# Altium project PCB_Project.PrjPcb
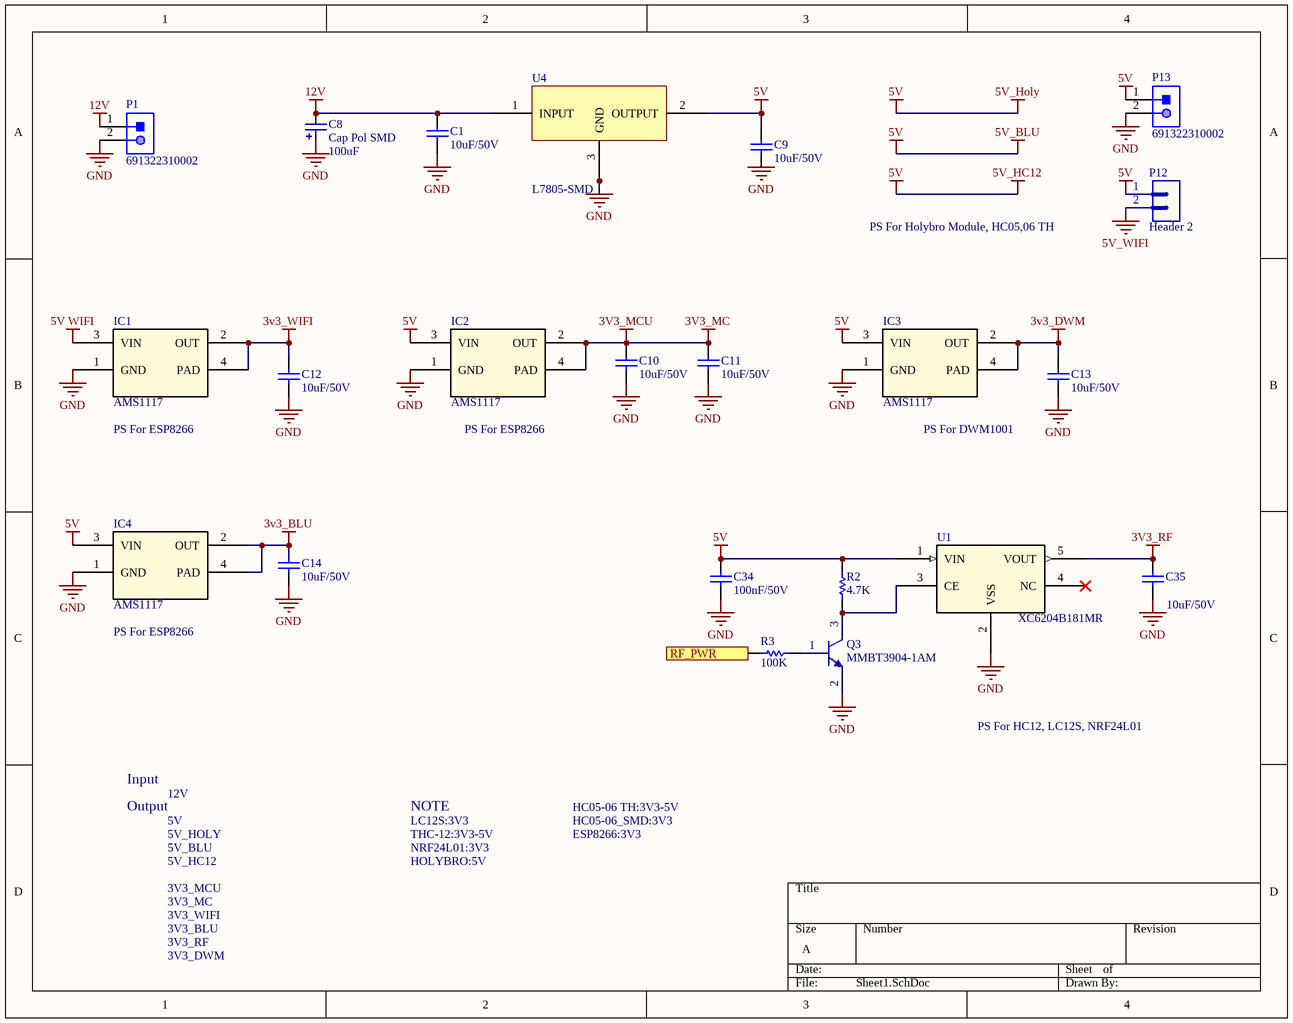
[diagram p0: Sheet1.SchDoc]
8 sheets, 150 parts. Net scope: flat (ports and power ports of the same name join across sheets).
Board file: PCB1.PcbDoc
Sheets:
  Sheet1.SchDoc
  Sheet2.SchDoc
  Sheet3.SchDoc
  Sheet4.SchDoc
  Sheet6.SchDoc
  Sheet5.SchDoc
  Sheet8.SchDoc
  Sheet7.SchDoc

## Sheet Sheet1.SchDoc
size A

### Parts
(Parts that share a designator on the sheet are numbered #1, #2 ... from top to bottom, then left to right.)
C1  value 10uF/50V  [CAP-SM-0805]  (hidden comment: Cap-10uF-50V-0805)
C8  Cap Pol SMD  value 100uF  [CAP ALU SIZE B]
C9  value 10uF/50V  [CAP-SM-0805]  (hidden comment: Cap-10uF-50V-0805)
C10  value 10uF/50V  [CAP-SM-0805]  (hidden comment: Cap-10uF-50V-0805)
C11  value 10uF/50V  [CAP-SM-0805]  (hidden comment: Cap-10uF-50V-0805)
C12  value 10uF/50V  [CAP-SM-0805]  (hidden comment: Cap-10uF-50V-0805)
C13  value 10uF/50V  [CAP-SM-0805]  (hidden comment: Cap-10uF-50V-0805)
C14  value 10uF/50V  [CAP-SM-0805]  (hidden comment: Cap-10uF-50V-0805)
C34  value 100nF/50V  [CAP-SM-0805]  (hidden comment: Cap-100nF-50V-0805)
C35  value 10uF/50V  [CAP-SM-0805]  (hidden comment: Cap-10uF-50V-0805)
IC1  AMS1117  [AMS1117]
IC2  AMS1117  [AMS1117]
IC3  AMS1117  [AMS1117]
IC4  AMS1117  [AMS1117]
P1  691322310002  [691322310002]
P12#1  Header 2  [JP2]
P13#1  691322310002  [691322310002]
Q3  MMBT3904-1AM  [SOT23_NEX]
R2  value 4.7K  [RES-SM-0805]  (hidden comment: Res-1K-0805)
R3  value 100K  [RES-SM-0805]  (hidden comment: Res-1K-0805)
U1  XC6204B181MR  [XC6204B332MR]
U4#1  L7805-SMD  [L7805-SMD]

### Ports
RF_PWR (in)

### Nets
3v3_BLU: C14.2 IC4.2(OUT) IC4.4(PAD)
3v3_DWM: C13.2 IC3.2(OUT) IC3.4(PAD)
3V3_MC: C10.2 C11.2 IC2.2(OUT) IC2.4(PAD)  [also labelled 3V3_MCU]
3V3_RF: C35.2 U1.5(VOUT)
3v3_WIFI: C12.2 IC1.2(OUT) IC1.4(PAD)
5V: C9.2 C34.2 IC2.3(VIN) IC3.3(VIN) IC4.3(VIN) P12#1.1 P13#1.1 R2.2 U1.1(VIN) U4#1.2(OUTPUT)  [also labelled 5V_BLU, 5V_HC12, 5V_Holy]
5V WIFI: IC1.3(VIN)
5V_WIFI: P12#1.2
12V: C1.2 C8.2 P1.1 U4#1.1(INPUT)
GND: C1.1 C8.1 C10.1 C11.1 C12.1 C13.1 C14.1 C34.1 C35.1 IC1.1(GND) IC2.1(GND) IC3.1(GND) IC4.1(GND) P1.2 P13#1.2 Q3.2(E) U1.2(VSS) U4#1.3(GND)
NetCR1_15: R3.2 ; port RF_PWR
NetQ3_1: Q3.1(B) R3.1
NetQ3_3: Q3.3(C) R2.1 U1.3(CE)

Not connected (* = marked no-connect by the designer): C9 1; U1 4(NC)*

### Notes on the sheet
- PS For Holybro Module, HC05,06 TH
- PS For ESP8266
- PS For DWM1001
- PS For HC12, LC12S, NRF24L01
- Input
- Output
- 12V
- 5V
- 5V_HOLY
- NOTE
- LC12S:3V3
- THC-12:3V3-5V
- HC05-06 TH:3V3-5V
- HC05-06_SMD:3V3
- ESP8266:3V3
- 5V_BLU
- 5V_HC12
- 3V3_MCU
- 3V3_MC
- NRF24L01:3V3
- HOLYBRO:5V
- 3V3_WIFI
- 3V3_BLU
- 3V3_RF
- 3V3_DWM
- Labels drawn without touching a wire or pin: GND

### Library data of the parts
C1 C9-C14 C35 = Cap-10uF-50V-0805: CAP CER 10UF 50V X5R 0805; Manufacturer: Yageo; Manufacturer Part Number: CC0805KKX5R9BB106; Local Supplier: thegioiic; Local Supplier Link: https://thegioiic.com/products/tu-10uf-50v-0805; Supplier 1: Digikey; Supplier 1 Link: https://www.digikey.com/product-detail/en/yageo/CC0805KKX5R9BB106/311-3499-2-ND/7164383; Supplier 1 Part Number: 311-3499-2-ND
C8 = Cap Pol SMD: Polarized Capacitor (Radial)
C34 = Cap-100nF-50V-0805: CAP CER 0.1UF 50V Y5V 0805; Manufacturer: Samsung Electro-Mechanics; Manufacturer Part Number: CL21F104ZBCNNNC; Local Supplier: thegioiic; Local Supplier Link: https://thegioiic.com/products/tu-100nf-0-1uf-50v-0805; Supplier 1: Digikey; Supplier 1 Part Number: 1276-1007-1-ND; Supplier 1 Link: https://www.digikey.com/product-detail/en/samsung-electro-mechanics/CL21F104ZBCNNNC/1276-1007-1-ND/3889093
IC1-IC4 = AMS1117: Vendor: Advanced Monolithic Systems; Built_By: EMA_Matt; SourceLibrary: Advanced_Monolithic_Systems_10-16-2019; Copyright: Copyright (C) 2018 Accelerated Designs. All rights reserved; Manufacturer_Part_Number: AMS1117; RefDes: RefDes; Type: DEV
P1 P13#1 = 691322310002: WR-TBL Serie 322 Horizontal PCB Header, Pluggable, pitch 3.81mm, 2p; Compliance: RoHS; Modularity: No; Pin Number: 2; Rated Current [UL]: 10A; Working Voltage [UL]: 300VAC; ComponentLink1Description: Manufacturer; ComponentLink1URL: http://www.we-online.de; ComponentLink2URL: https://katalog.we-online.de/em/datasheet/691322310002.pdf; ComponentLink2Description: Datasheet; Mounting Technology: THT; Part Number: 691322310002; Packaging: Box; Operating Temperature: -40 to +105degC; PCB/Cable/Panel: PCB; Pitch: 3.81mm; Published Date: October 2019; Type: Horizontal; Publisher: Wurth Elektronik; Application: Pluggable
P12#1 = Header 2: Header, 2-Pin; LatestRevisionDate: 17-Jul-2002; LatestRevisionNote: Re-released for DXP Platform.; Publisher: Altium Limited
R2 R3 = Res-1K-0805: RES 1K OHM 1% 1/4W 0805; Manufacturer: Stackpole Electronics Inc; Manufacturer Part Number: RNCP0805FTD1K00; Local Supplier: thegioiic; Local Supplier Link: https://thegioiic.com/products/dien-tro-1k-ohm-0805-5; Supplier 1: Digikey; Supplier 1 Link: https://www.digikey.com/product-detail/en/stackpole-electronics-inc/RNCP0805FTD1K00/RNCP0805FTD1K00CT-ND/2240568; Supplier 1 Part Number: RNCP0805FTD1K00CT-ND
U1 = XC6204B181MR: Vendor: Torex Semiconductor; Built_By: EMA_UL_Team; SourceLibrary: Torex_2016-07-05_1; Manufacturer_Part_Number: XC6204B181MR; Copyright: Copyright (C) 2018 Accelerated Designs. All rights reserved; RefDes: RefDes; Type: DEV

## Sheet Sheet2.SchDoc
size A4
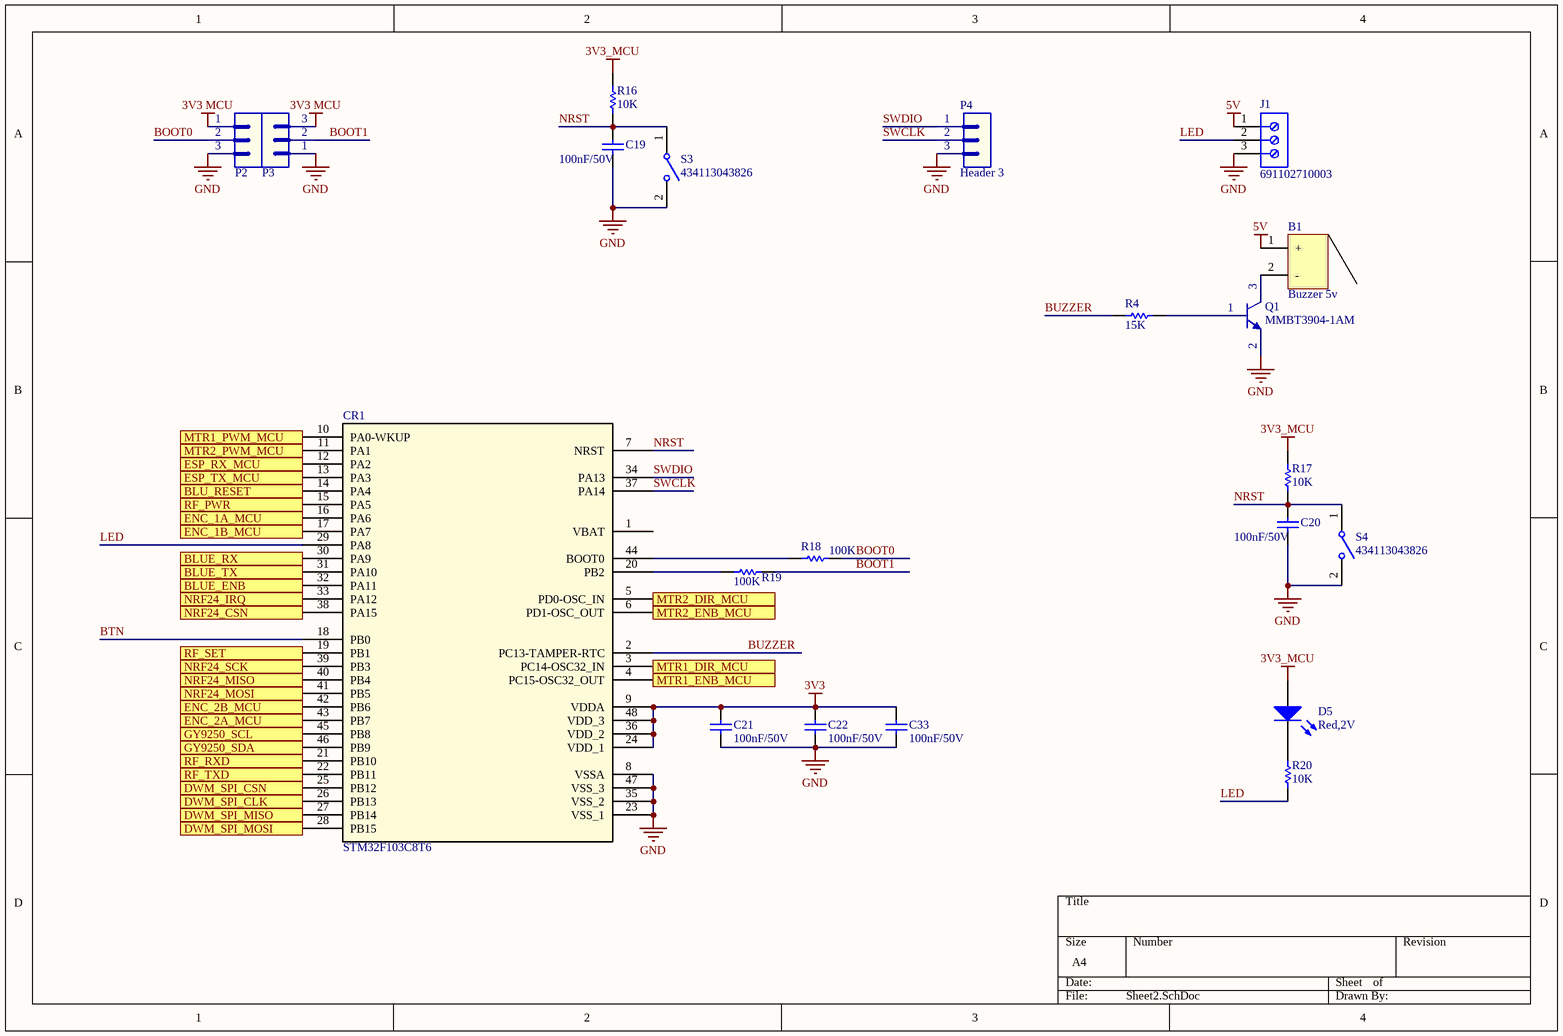
[diagram p1: Sheet2.SchDoc]

### Parts
(Parts that share a designator on the sheet are numbered #1, #2 ... from top to bottom, then left to right.)
B1  Buzzer 5v  [Buzzer 5v]
C19  value 100nF/50V  [CAP-SM-0805]  (hidden comment: Cap-1nF-50V-0805)
C20  value 100nF/50V  [CAP-SM-0805]  (hidden comment: Cap-1nF-50V-0805)
C21  value 100nF/50V  [CAP-SM-0805]  (hidden comment: Cap-1nF-50V-0805)
C22  value 100nF/50V  [CAP-SM-0805]  (hidden comment: Cap-1nF-50V-0805)
C33  value 100nF/50V  [CAP-SM-0805]  (hidden comment: Cap-1nF-50V-0805)
CR1  STM32F103C8T6  [STM32F103C8T6]
D5  value Red,2V  [LED-3mm]  (hidden comment: LED-RED-TH-3mm)
J1  691102710003  [691102710003]
P2  (no value)  [jp3]
P3  (no value)  [jp3]
P4  Header 3  [jp3]
Q1  MMBT3904-1AM  [SOT23_NEX]
R4  value 15K  [RES-SM-0805]  (hidden comment: Res-12K-0805)
R16  value 10K  [RES-SM-0805]  (hidden comment: Res-0-0805)
R17  value 10K  [RES-SM-0805]  (hidden comment: Res-0-0805)
R18  value 100K  [RES-SM-0805]  (hidden comment: Res-1K-0805)
R19#1  value 100K  [RES-SM-0805]  (hidden comment: Res-1K-0805)
R20  value 10K  [RES-SM-0805]  (hidden comment: Res-0-0805)
S3#1  434113043826  [434113043826]
S4#1  434113043826  [434113043826]

### Ports
BLU_RESET (out), BLUE_ENB (out), BLUE_RX (out), BLUE_TX (in), DWM_SPI_CLK (out), DWM_SPI_CSN (out), DWM_SPI_MISO (in), DWM_SPI_MOSI (out), ENC_1A_MCU (in), ENC_1B_MCU (in), ENC_2A_MCU (in), ENC_2B_MCU (in), ESP_RX_MCU (out), ESP_TX_MCU (in), GY9250_SCL (out), GY9250_SDA (out), MTR1_DIR_MCU (out), MTR1_ENB_MCU (out), MTR1_PWM_MCU (out), MTR2_DIR_MCU (out), MTR2_ENB_MCU (out), MTR2_PWM_MCU (out), NRF24_CSN (out), NRF24_IRQ (in), NRF24_MISO (in), NRF24_MOSI (out), NRF24_SCK (out), RF_PWR (out), RF_RXD (out), RF_SET (out), RF_TXD (in)

### Nets
3V3: C21.2 C22.2 C33.2 CR1.9(VDDA) CR1.24(VDD_1) CR1.36(VDD_2) CR1.48(VDD_3)
3V3 MCU: P2.1 P3.3
3V3_MCU: D5.1(A) R16.2 R17.2  [project net 3V3_MC]
5V: B1.1(+) J1.1
GND: C19.1 C20.1 C21.1 C22.1 C33.1 CR1.8(VSSA) CR1.23(VSS_1) CR1.35(VSS_2) CR1.47(VSS_3) J1.3 P2.3 P3.1 P4.3 Q1.2(E) S3#1.2 S4#1.2
BLUE_RX: CR1.30(PA9) ; port BLUE_RX
BOOT0: P2.2 R18.2
BOOT1: P3.2 R19#1.2
BTN: CR1.18(PB0)
BUZZER: CR1.2(PC13-TAMPER-RTC) R4.1
DWM_SPI_CLK: CR1.26(PB13) ; port DWM_SPI_CLK
DWM_SPI_CSn: CR1.25(PB12) ; port DWM_SPI_CSN
DWM_SPI_MISO: CR1.27(PB14) ; port DWM_SPI_MISO
DWM_SPI_MOSI: CR1.28(PB15) ; port DWM_SPI_MOSI
ESP_TX: CR1.13(PA3) ; port ESP_TX_MCU
LED: CR1.29(PA8) J1.2 R20.1
NRST: C19.2 C20.2 CR1.7(NRST) R16.1 R17.1 S3#1.1 S4#1.1
RF_RXD: CR1.21(PB10) ; port RF_RXD
RF_SET: CR1.19(PB1) ; port RF_SET
RF_TXD: CR1.22(PB11) ; port RF_TXD
SWCLK: CR1.37(PA14) P4.2
SWDIO: CR1.34(PA13) P4.1
NetB1_2: B1.2(-) Q1.3(C)
NetCR1_3: CR1.3(PC14-OSC32_IN) ; port MTR1_DIR_MCU
NetCR1_4: CR1.4(PC15-OSC32_OUT) ; port MTR1_ENB_MCU
NetCR1_5: CR1.5(PD0-OSC_IN) ; port MTR2_DIR_MCU
NetCR1_6: CR1.6(PD1-OSC_OUT) ; port MTR2_ENB_MCU
NetCR1_10: CR1.10(PA0-WKUP) ; port MTR1_PWM_MCU
NetCR1_11: CR1.11(PA1) ; port MTR2_PWM_MCU
NetCR1_12: CR1.12(PA2) ; port ESP_RX_MCU
NetCR1_14: CR1.14(PA4) ; port BLU_RESET
NetCR1_15: CR1.15(PA5) ; port RF_PWR
NetCR1_16: CR1.16(PA6) ; port ENC_1A_MCU
NetCR1_17: CR1.17(PA7) ; port ENC_1B_MCU
NetCR1_20: CR1.20(PB2) R19#1.1
NetCR1_31: CR1.31(PA10) ; port BLUE_TX
NetCR1_32: CR1.32(PA11) ; port BLUE_ENB
NetCR1_33: CR1.33(PA12) ; port NRF24_IRQ
NetCR1_38: CR1.38(PA15) ; port NRF24_CSN
NetCR1_39: CR1.39(PB3) ; port NRF24_SCK
NetCR1_40: CR1.40(PB4) ; port NRF24_MISO
NetCR1_41: CR1.41(PB5) ; port NRF24_MOSI
NetCR1_42: CR1.42(PB6) ; port ENC_2B_MCU
NetCR1_43: CR1.43(PB7) ; port ENC_2A_MCU
NetCR1_44: CR1.44(BOOT0) R18.1
NetCR1_45: CR1.45(PB8) ; port GY9250_SCL
NetCR1_46: CR1.46(PB9) ; port GY9250_SDA
NetD5_2: D5.2(K) R20.2
NetQ1_1: Q1.1(B) R4.2

Not connected (* = marked no-connect by the designer): CR1 1(VBAT)

### Library data of the parts
C19-C22 C33 = Cap-1nF-50V-0805: CAP CER 1000PF 100V X7R 0805; Manufacturer: Johanson Dielectrics Inc.; Manufacturer Part Number: 101X15W102MV4E; Local Supplier: thegioiic; Local Supplier Link: https://thegioiic.com/products/tu-1nf-50v-0805; Supplier 1: Digikey; Supplier 1 Link: https://www.digikey.com/product-detail/en/johanson-dielectrics-inc/101X15W102MV4E/709-1335-1-ND/2327235; Supplier 1 Part Number: 709-1335-1-ND
CR1 = STM32F103C8T6: SourceLibrary: StMicro_2011-06-07; Built_By: EMA_UL_Team; Vendor: STMicroelectronics; Type: DEV; Manufacturer_Part_Number: STM32F103C8T6; Copyright: Copyright (C) 2018 Accelerated Designs. All rights reserved; RefDes: RefDes
D5 = LED-RED-TH-3mm: LED RED CLEAR T-1 T/H; Manufacturer: Kingbright; Manufacturer Part Number: WP710A10SEC/J3; Local Supplier: thegioiic; Local Supplier Link: https://thegioiic.com/products/led-do-3mm-chan-dai; Supplier 1: Digikey; Supplier 1 Link: https://www.digikey.com/product-detail/en/kingbright/WP710A10SEC-J3/754-1589-ND/2769815; Supplier 1 Part Number: 754-1589-ND
J1 = 691102710003: WR-TBL Serie 102 Horizontal Entry Modular, Pressure Clamp, pitch 5mm, 3p; Compliance: Lead free / RoHS; Modularity: Yes; PCB/Cable/Panel: PCB; Pin Number: 3; Rated Current [UL]: 15A; Working Voltage [UL]: 250VAC; ComponentLink1Description: Manufacturer; ComponentLink1URL: http://www.we-online.de; ComponentLink2URL: https://katalog.we-online.de/em/datasheet/691102710003.pdf; ComponentLink2Description: Datasheet; Mounting Technology: THT; Part Number: 691102710003; Packaging: Box; Operating Temperature: -40 to +105degC; Pitch: 5mm; Published Date: October 2019; Type: Horizontal; Publisher: Wurth Elektronik; Application: Pressure Clamp
P2-P4 = Header 3: Header, 3-Pin; LatestRevisionDate: 17-Jul-2002; LatestRevisionNote: Re-released for DXP Platform.; Publisher: Altium Limited
R4 = Res-12K-0805: RES 12 KOHM JUMPER 0805; Manufacturer: Vishay Thin Film; Manufacturer Part Number: PAT0805E3121BST1; Local Supplier: icdayroi; Local Supplier Link: https://icdayroi.com/dien-tro-12k-0805-1-goi-50-con; Supplier 1: Digikey; Supplier 1 Link: https://www.digikey.com/product-detail/en/vishay-thin-film/PAT0805E3121BST1/PAT0805E3121BST1-ND/2281536; Supplier 1 Part Number: PAT0805E3121BST1-ND
R16 R17 R20 = Res-0-0805: RES 0 OHM JUMPER 0805; Manufacturer: Vishay Dale; Manufacturer Part Number: WSL080500000ZEA9; Local Supplier: thegioiic; Local Supplier Link: https://thegioiic.com/products/dien-tro-0-ohm-0805-5; Supplier 1: Digikey; Supplier 1 Link: https://www.digikey.com/product-detail/en/vishay-dale/WSL080500000ZEA9/541-3928-1-ND/7423223; Supplier 1 Part Number: 541-3928-1-ND
R18 R19#1 = Res-1K-0805: as R2 on sheet Sheet1; Local Supplier: thegioiic; Local Supplier Link: https://thegioiic.com/products/dien-tro-1k-ohm-0805-5; Supplier 1: Digikey; Supplier 1 Link: https://www.digikey.com/product-detail/en/stackpole-electronics-inc/RNCP0805FTD1K00/RNCP0805FTD1K00CT-ND/2240568; Supplier 1 Part Number: RNCP0805FTD1K00CT-ND
S3#1 S4#1 = 434113043826: WS-TASV J-Bend SMT Tact Switch 6x3.5mm, height 4.3mm, 260gf; Rated Voltage: 12VDC; Rated Current: 50mA; Washable: No; ComponentLink1Description: Manufacturer; ComponentLink1URL: http://www.we-online.de; ComponentLink2Description: Datasheet; ComponentLink2URL: https://katalog.we-online.com/em/datasheet/434113043826.pdf; Operating Temperature: -40 to +85degC; Part Number: 434113043826; Published Date: September 2019; Contact Material: Stainless Steel; Height: 4.3mm; Mounting Technology: SMT; Contact Plating: Silver; Operation Force: 260gf; Packaging: Tape and Reel; Terminal Material: Copper Alloy; Publisher: Wurth Elektronik; Terminal Plating: Silver

## Sheet Sheet3.SchDoc
size A4
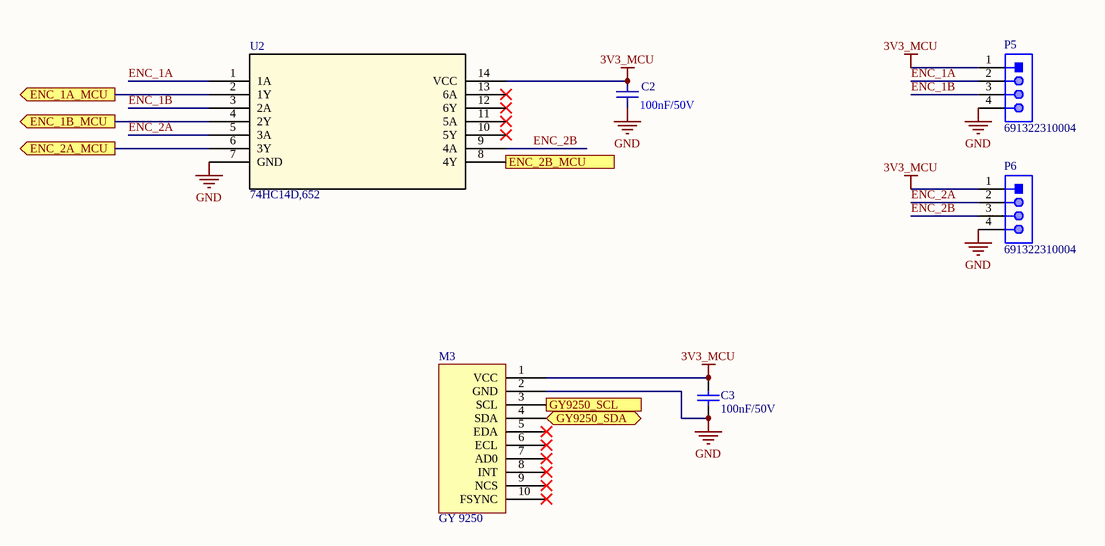
[diagram p2: Sheet3.SchDoc]

### Parts
(Parts that share a designator on the sheet are numbered #1, #2 ... from top to bottom, then left to right.)
C2  value 100nF/50V  [CAP-SM-0805]  (hidden comment: Cap Non-Pol SMD)
C3  value 100nF/50V  [CAP-SM-0805]  (hidden comment: Cap-1nF-50V-0805)
M3#1  GY 9250  [GY 9250]
P5  691322310004  [691322310004]
P6  691322310004  [691322310004]
U2  74HC14D,652  [74HC14D,652]

### Ports
ENC_1A_MCU (out), ENC_1B_MCU (out), ENC_2A_MCU (out), ENC_2B_MCU (out), GY9250_SCL (in), GY9250_SDA (bidir)

### Nets
3V3_MCU: C2.2 C3.2 M3#1.1(VCC) P5.1 P6.1 U2.14(VCC)  [project net 3V3_MC]
GND: C2.1 C3.1 M3#1.2(GND) P5.4 P6.4 U2.7(GND)
ENC_1A: P5.2 U2.1(1A)
ENC_1B: P5.3 U2.3(2A)
ENC_2A: P6.2 U2.5(3A)
ENC_2B: P6.3 U2.9(4A)
NetCR1_16: U2.2(1Y) ; port ENC_1A_MCU
NetCR1_17: U2.4(2Y) ; port ENC_1B_MCU
NetCR1_42: U2.8(4Y) ; port ENC_2B_MCU
NetCR1_43: U2.6(3Y) ; port ENC_2A_MCU
NetCR1_45: M3#1.3(SCL) ; port GY9250_SCL
NetCR1_46: M3#1.4(SDA) ; port GY9250_SDA

Not connected (* = marked no-connect by the designer): M3#1 5(EDA)* 6(ECL)* 7(AD0)* 8(INT)* 9(NCS)* 10(FSYNC)*; U2 10(5Y)* 11(5A)* 12(6Y)* 13(6A)*

### Library data of the parts
C2 = Cap Non-Pol SMD: Capacitor
C3 = Cap-1nF-50V-0805: as C19 on sheet Sheet2; Local Supplier: thegioiic; Local Supplier Link: https://thegioiic.com/products/tu-1nf-50v-0805; Supplier 1: Digikey; Supplier 1 Link: https://www.digikey.com/product-detail/en/johanson-dielectrics-inc/101X15W102MV4E/709-1335-1-ND/2327235; Supplier 1 Part Number: 709-1335-1-ND
P5 P6 = 691322310004: WR-TBL Serie 322 Horizontal PCB Header, Pluggable, pitch 3.81mm, 4p; Compliance: RoHS; Modularity: No; Pin Number: 4; Rated Current [UL]: 10A; Working Voltage [UL]: 300VAC; ComponentLink1Description: Manufacturer; ComponentLink1URL: http://www.we-online.de; ComponentLink2URL: https://katalog.we-online.de/em/datasheet/691322310004.pdf; ComponentLink2Description: Datasheet; Mounting Technology: THT; Part Number: 691322310004; Packaging: Box; Operating Temperature: -40 to +105degC; PCB/Cable/Panel: PCB; Pitch: 3.81mm; Published Date: October 2019; Type: Horizontal; Publisher: Wurth Elektronik; Application: Pluggable
U2 = 74HC14D,652: Vendor: Nexperia; SourceLibrary: Nexperia_2018-05-2018; Manufacturer_Part_Number: 74HC14D,652; Copyright: Copyright (C) 2016 Accelerated Designs. All rights reserved; RefDes: RefDes; Type: DEV

## Sheet Sheet4.SchDoc
size A4
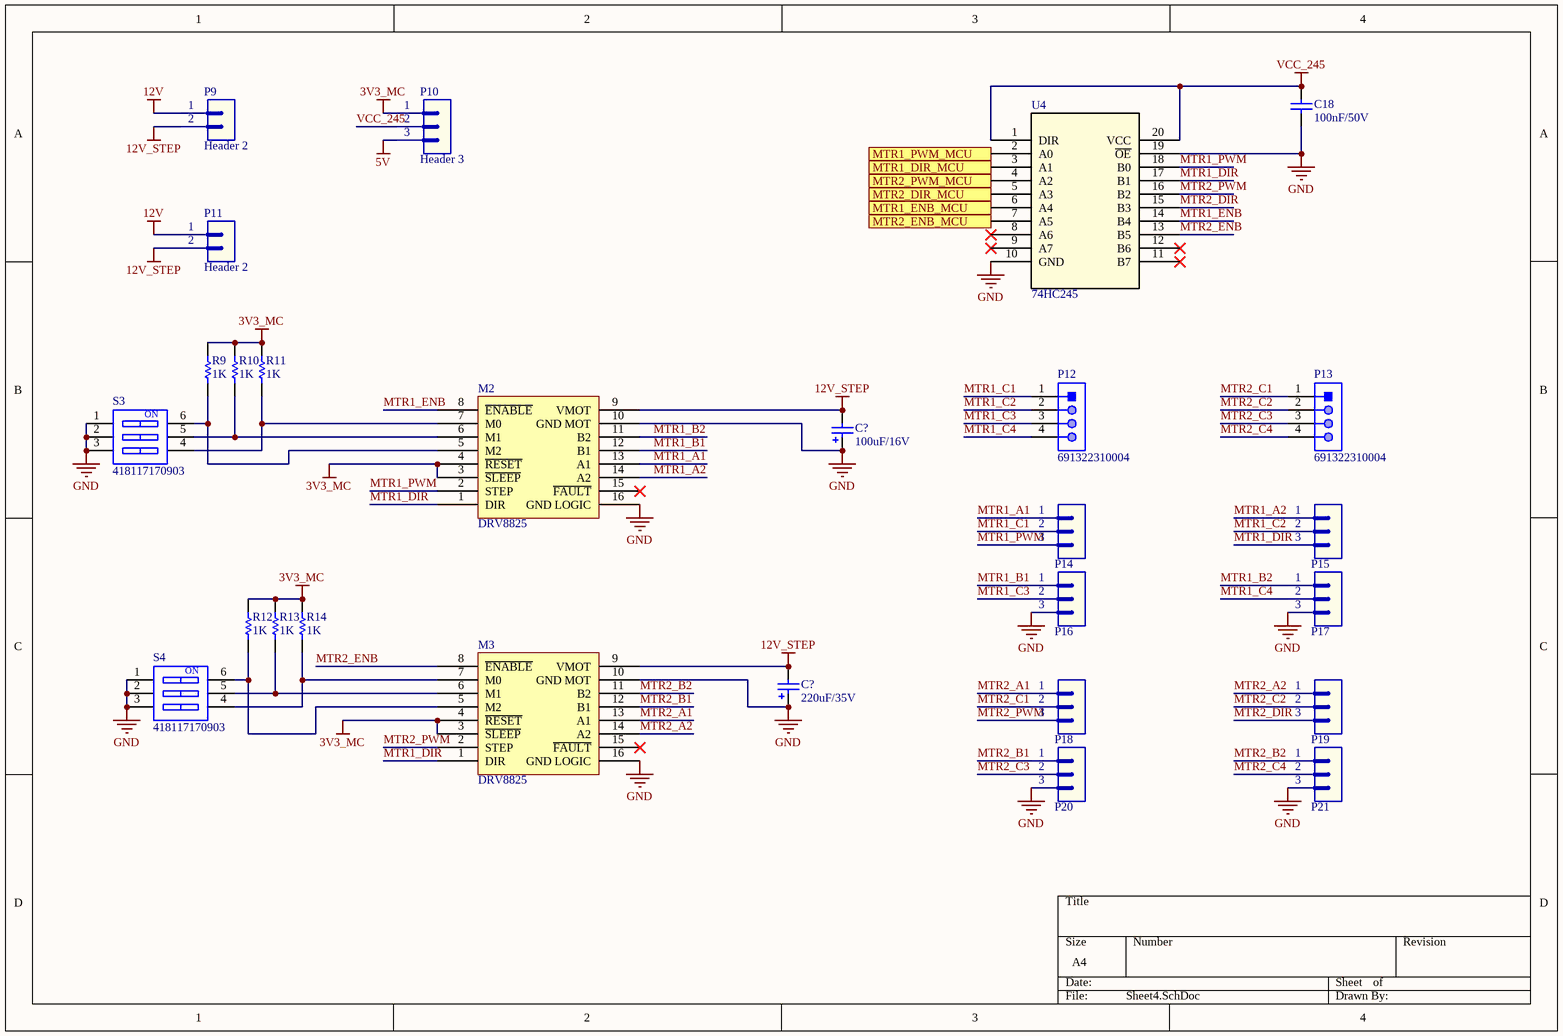
[diagram p3: Sheet4.SchDoc]

### Parts
(Parts that share a designator on the sheet are numbered #1, #2 ... from top to bottom, then left to right.)
C18#1  value 100nF/50V  [CAP-SM-0805]  (hidden comment: Cap-10uF-50V-0805)
C?#1  value 100uF/16V  [CAP-SM-AL-SIZE-D-D6L6]  (hidden comment: Cap-Al-100uF-16V-D6L5)
C?#2  value 220uF/35V  [CAP-SM-AL-SIZE-F-D8L10]  (hidden comment: Cap-Al-220uF-35V-D8L10)
M2  DRV8825  [DRV8825]
M3#2  DRV8825  [DRV8825]
P9  Header 2  [JP2]
P10  Header 3  [JP3]
P11  Header 2  [JP2]
P12#2  691322310004  [691322310004]
P13#2  691322310004  [691322310004]
P14  Header 3  [JP3]  (value not drawn)
P15  Header 3  [JP3]  (value not drawn)
P16#1  Header 3  [JP3]  (value not drawn)
P17#1  Header 3  [JP3]  (value not drawn)
P18#1  Header 3  [JP3]  (value not drawn)
P19#1  Header 3  [JP3]  (value not drawn)
P20#1  Header 3  [JP3]  (value not drawn)
P21#1  Header 3  [JP3]  (value not drawn)
R9  value 1K  [RES-SM-0805]  (hidden comment: Res-1K-0805)
R10  value 1K  [RES-SM-0805]  (hidden comment: Res-1K-0805)
R11#1  value 1K  [RES-SM-0805]  (hidden comment: Res-1K-0805)
R12#1  value 1K  [RES-SM-0805]  (hidden comment: Res-1K-0805)
R13#1  value 1K  [RES-SM-0805]  (hidden comment: Res-1K-0805)
R14#1  value 1K  [RES-SM-0805]  (hidden comment: Res-1K-0805)
S3#2  418117170903  [418117170903]
S4#2  418117170903  [418117170903]
U4#2  74HC245  [74HC245,625]

### Ports
MTR1_DIR_MCU (in), MTR1_ENB_MCU (in), MTR1_PWM_MCU (in), MTR2_DIR_MCU (in), MTR2_ENB_MCU (in), MTR2_PWM_MCU (in)

### Nets
3V3_MC: M2.3(~{SLEEP}) M2.4(~{RESET}) M3#2.3(~{SLEEP}) M3#2.4(~{RESET}) P10.1 R9.2 R10.2 R11#1.2 R12#1.2 R13#1.2 R14#1.2
5V: P10.3
12V: P9.1 P11.1
12V_STEP: C?#1.2 C?#2.2 M2.9(VMOT) M3#2.9(VMOT) P9.2 P11.2
GND: C18#1.1 C?#1.1 C?#2.1 M2.10(GND_MOT) M2.16(GND_LOGIC) M3#2.10(GND_MOT) M3#2.16(GND_LOGIC) P16#1.3 P17#1.3 P20#1.3 P21#1.3 S3#2.1 S3#2.2 S3#2.3 S4#2.1 S4#2.2 S4#2.3 U4#2.10(GND) U4#2.19(~{OE})
VCC_245: C18#1.2 P10.2 U4#2.1(DIR) U4#2.20(VCC)
MTR1_A1: M2.13(A1) P14.1
MTR1_A2: M2.14(A2) P15.1
MTR1_B1: M2.12(B1) P16#1.1
MTR1_B2: M2.11(B2) P17#1.1
MTR1_C1: P12#2.1 P14.2
MTR1_C2: P12#2.2 P15.2
MTR1_C3: P12#2.3 P16#1.2
MTR1_C4: P12#2.4 P17#1.2
MTR1_DIR: M2.1(DIR) M3#2.1(DIR) P15.3 U4#2.17(B1)
MTR1_ENB: M2.8(~{ENABLE}) U4#2.14(B4)
MTR1_PWM: M2.2(STEP) P14.3 U4#2.18(B0)
MTR2_A1: M3#2.13(A1) P18#1.1
MTR2_A2: M3#2.14(A2) P19#1.1
MTR2_B1: M3#2.12(B1) P20#1.1
MTR2_B2: M3#2.11(B2) P21#1.1
MTR2_C1: P13#2.1 P18#1.2
MTR2_C2: P13#2.2 P19#1.2
MTR2_C3: P13#2.3 P20#1.2
MTR2_C4: P13#2.4 P21#1.2
MTR2_DIR: P19#1.3 U4#2.15(B3)
MTR2_ENB: M3#2.8(~{ENABLE}) U4#2.13(B5)
MTR2_PWM: M3#2.2(STEP) P18#1.3 U4#2.16(B2)
NetCR1_3: U4#2.3(A1) ; port MTR1_DIR_MCU
NetCR1_4: U4#2.6(A4) ; port MTR1_ENB_MCU
NetCR1_5: U4#2.5(A3) ; port MTR2_DIR_MCU
NetCR1_6: U4#2.7(A5) ; port MTR2_ENB_MCU
NetCR1_10: U4#2.2(A0) ; port MTR1_PWM_MCU
NetCR1_11: U4#2.4(A2) ; port MTR2_PWM_MCU
NetM2_5: M2.5(M2) R9.1 S3#2.6
NetM2_6: M2.6(M1) R10.1 S3#2.5
NetM2_7: M2.7(M0) R11#1.1 S3#2.4
NetM3#2_5: M3#2.5(M2) R12#1.1 S4#2.6
NetM3#2_6: M3#2.6(M1) R13#1.1 S4#2.5
NetM3#2_7: M3#2.7(M0) R14#1.1 S4#2.4

Not connected (* = marked no-connect by the designer): M2 15(~{FAULT})*; M3#2 15(~{FAULT})*; U4#2 8(A6)* 9(A7)* 11(B7)* 12(B6)*

### Notes on the sheet
- (in symbol 418117170903) ON

### Library data of the parts
C18#1 = Cap-10uF-50V-0805: as C1 on sheet Sheet1; Local Supplier: thegioiic; Local Supplier Link: https://thegioiic.com/products/tu-10uf-50v-0805; Supplier 1: Digikey; Supplier 1 Link: https://www.digikey.com/product-detail/en/yageo/CC0805KKX5R9BB106/311-3499-2-ND/7164383; Supplier 1 Part Number: 311-3499-2-ND
C?#1 = Cap-Al-100uF-16V-D6L5: CAP ALUM 100UF 20% 16V SMD; Manufacturer: Nichicon; Manufacturer Part Number: UWX1C101MCL1GB; Local Supplier: thegioiic; Local Supplier Link: https://thegioiic.com/products/tu-nhom-smd-100uf-16v-d6-3l5-4; Supplier 1: Digikey; Supplier 1 Part Number: 493-2105-1-ND; Supplier 1 Link: https://www.digikey.com/product-detail/en/nichicon/UWX1C101MCL1GB/493-2105-1-ND/590080
C?#2 = Cap-Al-220uF-35V-D8L10: CAP ALUM 220UF 20% 35V SMD; Manufacturer: Nichicon; Manufacturer Part Number: UWT1V221MNL1GS; Local Supplier: thegioiic; Local Supplier Link: https://thegioiic.com/products/tu-nhom-smd-220uf-35v-d8l10; Supplier 1: Digikey; Supplier 1 Link: https://www.digikey.com/product-detail/en/nichicon/UWT1V221MNL1GS/493-2205-2-ND/589946; Supplier 1 Part Number: 493-2205-2-ND
P9 P11 = Header 2: Header, 2-Pin; LatestRevisionDate: 17-Jul-2002; LatestRevisionNote: Re-released for DXP Platform.; Publisher: Altium Limited
P10 P14 P15 P16#1 P17#1 P18#1 P19#1 P20#1 P21#1 = Header 3: Header, 3-Pin; LatestRevisionDate: 17-Jul-2002; LatestRevisionNote: Re-released for DXP Platform.; Publisher: Altium Limited
P12#2 P13#2 = 691322310004: as P5 on sheet Sheet3; ComponentLink1Description: Manufacturer; ComponentLink1URL: http://www.we-online.de; ComponentLink2URL: https://katalog.we-online.de/em/datasheet/691322310004.pdf; ComponentLink2Description: Datasheet; Mounting Technology: THT; Part Number: 691322310004; Packaging: Box; Operating Temperature: -40 to +105degC; PCB/Cable/Panel: PCB; Pitch: 3.81mm; Published Date: October 2019; Type: Horizontal; Publisher: Wurth Elektronik; Application: Pluggable
R9 R10 R11#1 R12#1 R13#1 R14#1 = Res-1K-0805: as R2 on sheet Sheet1; Local Supplier: thegioiic; Local Supplier Link: https://thegioiic.com/products/dien-tro-1k-ohm-0805-5; Supplier 1: Digikey; Supplier 1 Link: https://www.digikey.com/product-detail/en/stackpole-electronics-inc/RNCP0805FTD1K00/RNCP0805FTD1K00CT-ND/2240568; Supplier 1 Part Number: RNCP0805FTD1K00CT-ND
S3#2 S4#2 = 418117170903: WS-DITV Compact THT Dip Switch, Flat Actuator, pitch 2.54mm, 3p; Operation Force: 800g; Pole Number: 3; Actuator Type: Flat Type; Circuit: SPST-NO; Rated Current Switching: 25mA; Rated Current Non-Switching: 100mA; Rated Voltage Non-Switching: 50VDC; Rated Voltage Switching: 24VDC; ComponentLink1Description: Manufacturer; ComponentLink1URL: http://www.we-online.de; ComponentLink2Description: Datasheet; ComponentLink2URL: https://katalog.we-online.com/em/datasheet/418117170903.pdf; Pitch: 2.54mm; Contact Material: Copper Alloy; Mounting Technology: THT; Operating Temperature: -40 to +85degC; Contact Plating: Gold; Packaging: Tube; Part Number: 418117170903; Publisher: Wurth Elektronik; Published Date: September 2019
U4#2 = 74HC245: No Description Available; Vendor: Texas Instruments; Built_By: EMA_UL_Team; SourceLibrary: TI_2002-01-01_7; Manufacturer_Part_Number: 74HC245; Copyright: Copyright (C) 2018 Accelerated Designs. All rights reserved; RefDes: RefDes; Type: DEV

## Sheet Sheet6.SchDoc
size A4
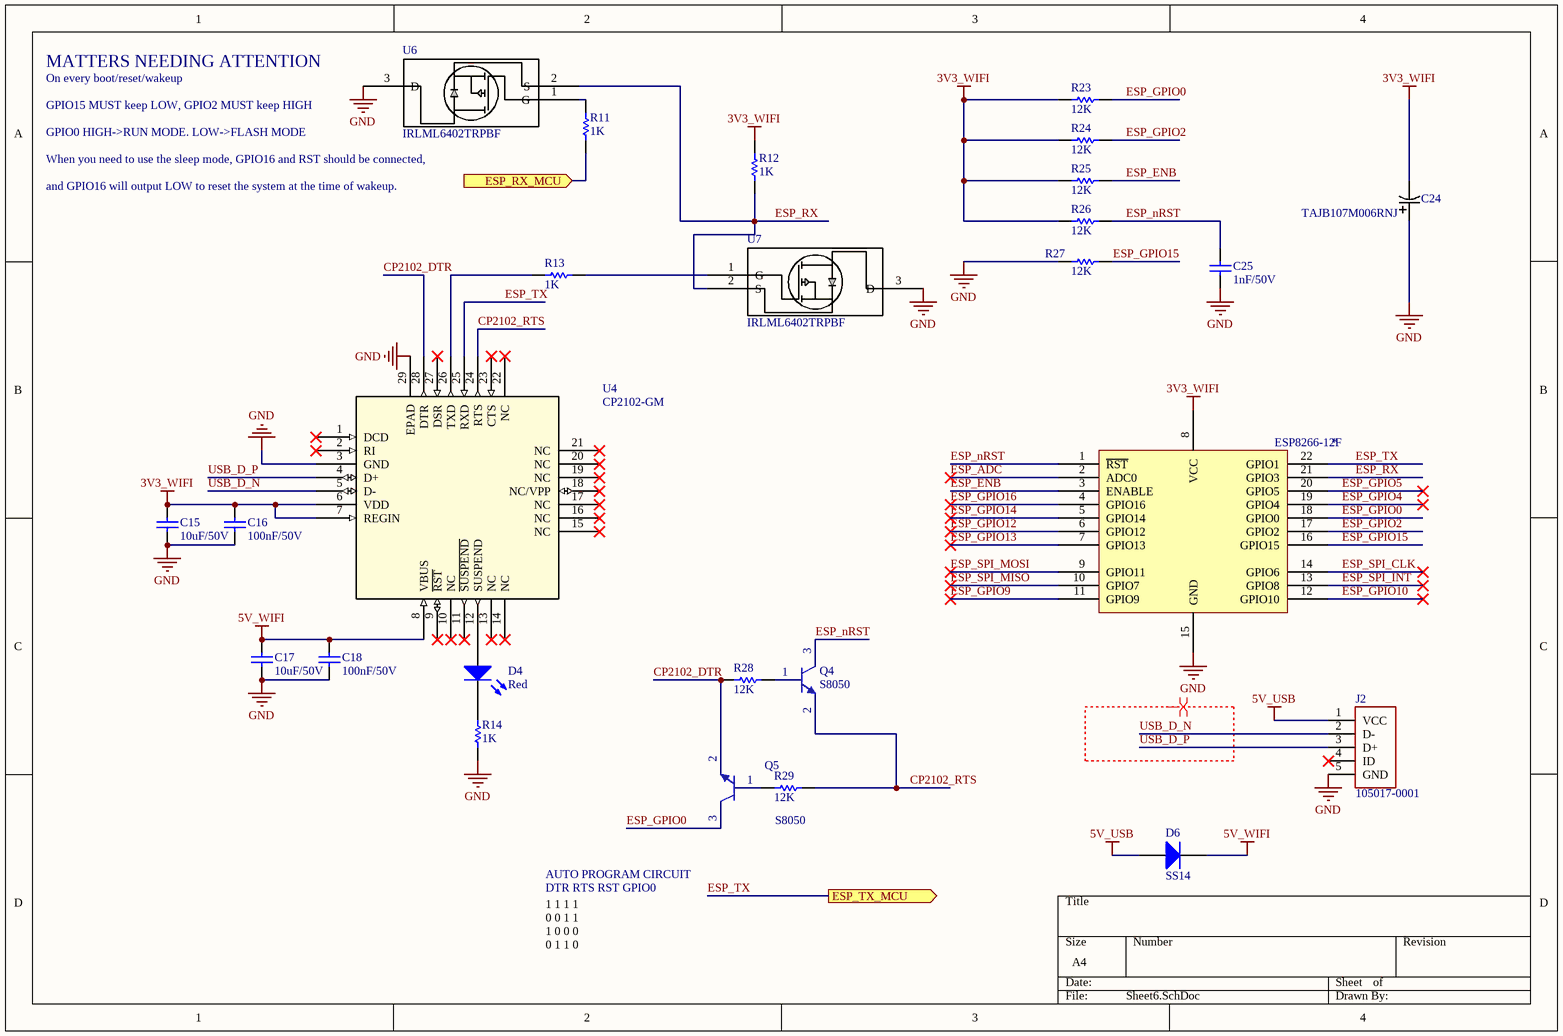
[diagram p4: Sheet6.SchDoc]

### Parts
(Parts that share a designator on the sheet are numbered #1, #2 ... from top to bottom, then left to right.)
*  ESP8266-12F  [ESP8266]
C15  value 10uF/50V  [CAP-SM-0805]  (hidden comment: Cap-1nF-50V-0805)
C16  value 100nF/50V  [CAP-SM-0805]  (hidden comment: Cap-1nF-50V-0805)
C17  value 10uF/50V  [CAP-SM-0805]  (hidden comment: Cap-1nF-50V-0805)
C18#2  value 100nF/50V  [CAP-SM-0805]  (hidden comment: Cap-1nF-50V-0805)
C24  TAJB107M006RNJ  [TAJB107M006RNJ]
C25  value 1nF/50V  [CAP-SM-0805]  (hidden comment: Cap-1nF-50V-0805)
D4  value Red  [LED-3mm]  (hidden comment: LED-RED-TH-3mm)
D6  SS14  [SS14]
J2  105017-0001  [CONN_105017-0001]
Q4  S8050  [SOT23_NEX]
Q5  S8050  [SOT23_NEX]
R11#2  value 1K  [RES-SM-0805]  (hidden comment: Res-470-0805)
R12#2  value 1K  [RES-SM-0805]  (hidden comment: Res-470-0805)
R13#2  value 1K  [RES-SM-0805]  (hidden comment: Res-470-0805)
R14#2  value 1K  [RES-SM-0805]  (hidden comment: Res-470-0805)
R23  value 12K  [RES-SM-0805]  (hidden comment: Res-0-0805)
R24  value 12K  [RES-SM-0805]  (hidden comment: Res-0-0805)
R25  value 12K  [RES-SM-0805]  (hidden comment: Res-0-0805)
R26  value 12K  [RES-SM-0805]  (hidden comment: Res-0-0805)
R27  value 12K  [RES-SM-0805]  (hidden comment: Res-0-0805)
R28  value 12K  [RES-SM-0805]  (hidden comment: Res-0-0805)
R29  value 12K  [RES-SM-0805]  (hidden comment: Res-0-0805)
U4#3  CP2102-GM  [cp2102-gm]
U6  IRLML6402TRPBF  [IRLML6402TRPBF]
U7  IRLML6402TRPBF  [IRLML6402TRPBF]

### Ports
ESP_RX_MCU (in), ESP_TX_MCU (out)

### Nets
3v3_WIFI: *.8(VCC) C15.2 C16.2 C24.2 R12#2.1 R23.1 R24.1 R25.1 R26.1 U4#3.6(VDD) U4#3.7(REGIN)
5V_USB: D6.2(A) J2.1(VCC)
5V_WIFI: C17.2 C18#2.2 D6.1(K) U4#3.8(VBUS)
GND: *.15(GND) C15.1 C16.1 C17.1 C18#2.1 C24.1 C25.1 J2.5(GND) R14#2.1 R27.1 U4#3.3(GND) U4#3.29(EPAD) U6.3(D) U7.3(D)
CP2102_DTR: Q5.2(E) R28.1 U4#3.28(DTR)
CP2102_RTS: Q4.2(E) R29.2 U4#3.24(RTS)
ESP_ADC: *.2(ADC0)
ESP_ENB: *.3(ENABLE) R25.2
ESP_GPIO0: *.18(GPIO0) Q5.3(C) R23.2
ESP_GPIO2: *.17(GPIO2) R24.2
ESP_GPIO4: *.19(GPIO4)
ESP_GPIO5: *.20(GPIO5)
ESP_GPIO9: *.11(GPIO9)
ESP_GPIO10: *.12(GPIO10)
ESP_GPIO12: *.6(GPIO12)
ESP_GPIO13: *.7(GPIO13)
ESP_GPIO14: *.5(GPIO14)
ESP_GPIO15: *.16(GPIO15) R27.2
ESP_GPIO16: *.4(GPIO16)
ESP_nRST: *.1(~{RST}) C25.2 Q4.3(C) R26.2
ESP_RX: *.21(GPIO3) R12#2.2 U6.2(S) U7.2(S)
ESP_SPI_CLK: *.14(GPIO6)
ESP_SPI_INT: *.13(GPIO8)
ESP_SPI_MISO: *.10(GPIO7)
ESP_SPI_MOSI: *.9(GPIO11)
ESP_TX: *.22(GPIO1) U4#3.25(RXD) ; port ESP_TX_MCU
USB_D_N: J2.2(D-) U4#3.5(D-)
USB_D_P: J2.3(D+) U4#3.4(D+)
NetCR1_12: R11#2.1 ; port ESP_RX_MCU
NetD4_1: D4.1(A) U4#3.12(SUSPEND)
NetD4_2: D4.2(K) R14#2.2
NetQ4_1: Q4.1(B) R28.2
NetQ5_1: Q5.1(B) R29.1
NetR11#2_2: R11#2.2 U6.1(G)
NetR13#2_1: R13#2.1 U7.1(G)
NetR13#2_2: R13#2.2 U4#3.26(TXD)

Not connected (* = marked no-connect by the designer): J2 4(ID)*; U4#3 1(DCD)* 2(RI)* 9(~{RST})* 10(NC)* 11(~{SUSP}~{END})* 13(NC)* 14(NC)* 15(NC)* 16(NC)* 17(NC)* 18(NC/VPP)* 19(NC)* 20(NC)* 21(NC)* 22(NC)* 23(CTS)* 27(DSR)*

### Layout directives
differential pair: (no net found under the mark)

### Notes on the sheet
- MATTERS NEEDING ATTENTION
- On every boot/reset/wakeup
- GPIO15 MUST keep LOW, GPIO2 MUST keep HIGH
- GPIO0 HIGH->RUN MODE. LOW->FLASH MODE
- When you need to use the sleep mode, GPIO16 and RST should be connected,
- and GPIO16 will output LOW to reset the system at the time of wakeup.
- AUTO PROGRAM CIRCUIT
- DTR RTS RST GPIO0
- 1 1 1 1
  0 0 1 1
  1 0 0 0
  0 1 1 0

### Library data of the parts
* = ESP8266-12F: Local supply: Hshop; Local supply link: https://www.elecrow.com/download/ESP-12F.pdf
C15-C17 C18#2 C25 = Cap-1nF-50V-0805: as C19 on sheet Sheet2; Local Supplier: thegioiic; Local Supplier Link: https://thegioiic.com/products/tu-1nf-50v-0805; Supplier 1: Digikey; Supplier 1 Link: https://www.digikey.com/product-detail/en/johanson-dielectrics-inc/101X15W102MV4E/709-1335-1-ND/2327235; Supplier 1 Part Number: 709-1335-1-ND
C24 = TAJB107M006RNJ: Vendor: AVX Corporation; Built_By: EMA_UL_Team; SourceLibrary: AVX_2015-1-12; Type: DEV; Manufacturer_Part_Number: TAJB107M006RNJ; Copyright: Copyright (C) 2018 Accelerated Designs. All rights reserved; RefDes: RefDes
D4 = LED-RED-TH-3mm: as D5 on sheet Sheet2; Local Supplier: thegioiic; Local Supplier Link: https://thegioiic.com/products/led-do-3mm-chan-dai; Supplier 1: Digikey; Supplier 1 Link: https://www.digikey.com/product-detail/en/kingbright/WP710A10SEC-J3/754-1589-ND/2769815; Supplier 1 Part Number: 754-1589-ND
D6 = Diode-SS14: DIODE SCHOTTKY 40V 1A SMA; Manufacturer: ON Semiconductor; Local Supplier: thegioiic; Local Supplier Link: https://thegioiic.com/products/ss14-sma; Supplier 1: Digikey; Supplier 1 Link: https://www.digikey.com/product-detail/en/on-semiconductor/SS14/SS14CT-ND/965729; Manufacturer Part Number: SS14; Supplier 1 Part Number: SS14CT-ND
J2 = 105017-0001: No Description Available; Vendor: Molex Connector Corporation; Built_By: EMA_Cory; SourceLibrary: Molex_2020-05-26; Datasheet: https://www.molex.com/pdm_docs/sd/1050170001_sd.pdf; Manufacturer_Part_Number: 105017-0001; Copyright: Copyright (C) 2018 Accelerated Designs. All rights reserved; RefDes: RefDes; Type: DEV
R11#2 R12#2 R13#2 R14#2 = Res-470-0805: RES 470 OHM JUMPER 0805; Manufacturer: YAG6006CT-ND; Manufacturer Part Number: PE0805FRF7W0R047L; Local Supplier: thegioiic; Local Supplier Link: https://www.thegioiic.com/products/dien-tro-470-kohm-0805-5; Supplier 1: Digikey; Supplier 1 Link: https://www.digikey.com/product-detail/en/yageo/PE0805FRF7W0R047L/YAG6006CT-ND/9696460; Supplier 1 Part Number: YAG6006CT-ND
R23-R29 = Res-0-0805: as R16 on sheet Sheet2; Local Supplier: thegioiic; Local Supplier Link: https://thegioiic.com/products/dien-tro-0-ohm-0805-5; Supplier 1: Digikey; Supplier 1 Link: https://www.digikey.com/product-detail/en/vishay-dale/WSL080500000ZEA9/541-3928-1-ND/7423223; Supplier 1 Part Number: 541-3928-1-ND
U4#3 = CP2102-GM: Vendor: Silicon Labs; Built_By: EMA_UL_Team; SourceLibrary: Silicon_Labs_2015-03-23; Manufacturer_Part_Number: CP2102-GM; Copyright: Copyright (C) 2018 Accelerated Designs. All rights reserved; RefDes: RefDes; Type: DEV
U6 U7 = IRLML6402TRPBF: No Description Available; Source_Library: Infineon_2020-02-27.xlr; Built_By: EMA_Justin; SourceLibrary: Infineon_2020-02-27; Vendor: Infineon; Copyright: Copyright (C) 2018 Accelerated Designs. All rights reserved; Manufacturer_Part_Number: IRLML6402TRPBF; RefDes: RefDes; Type: DEV

## Sheet Sheet5.SchDoc
size A4
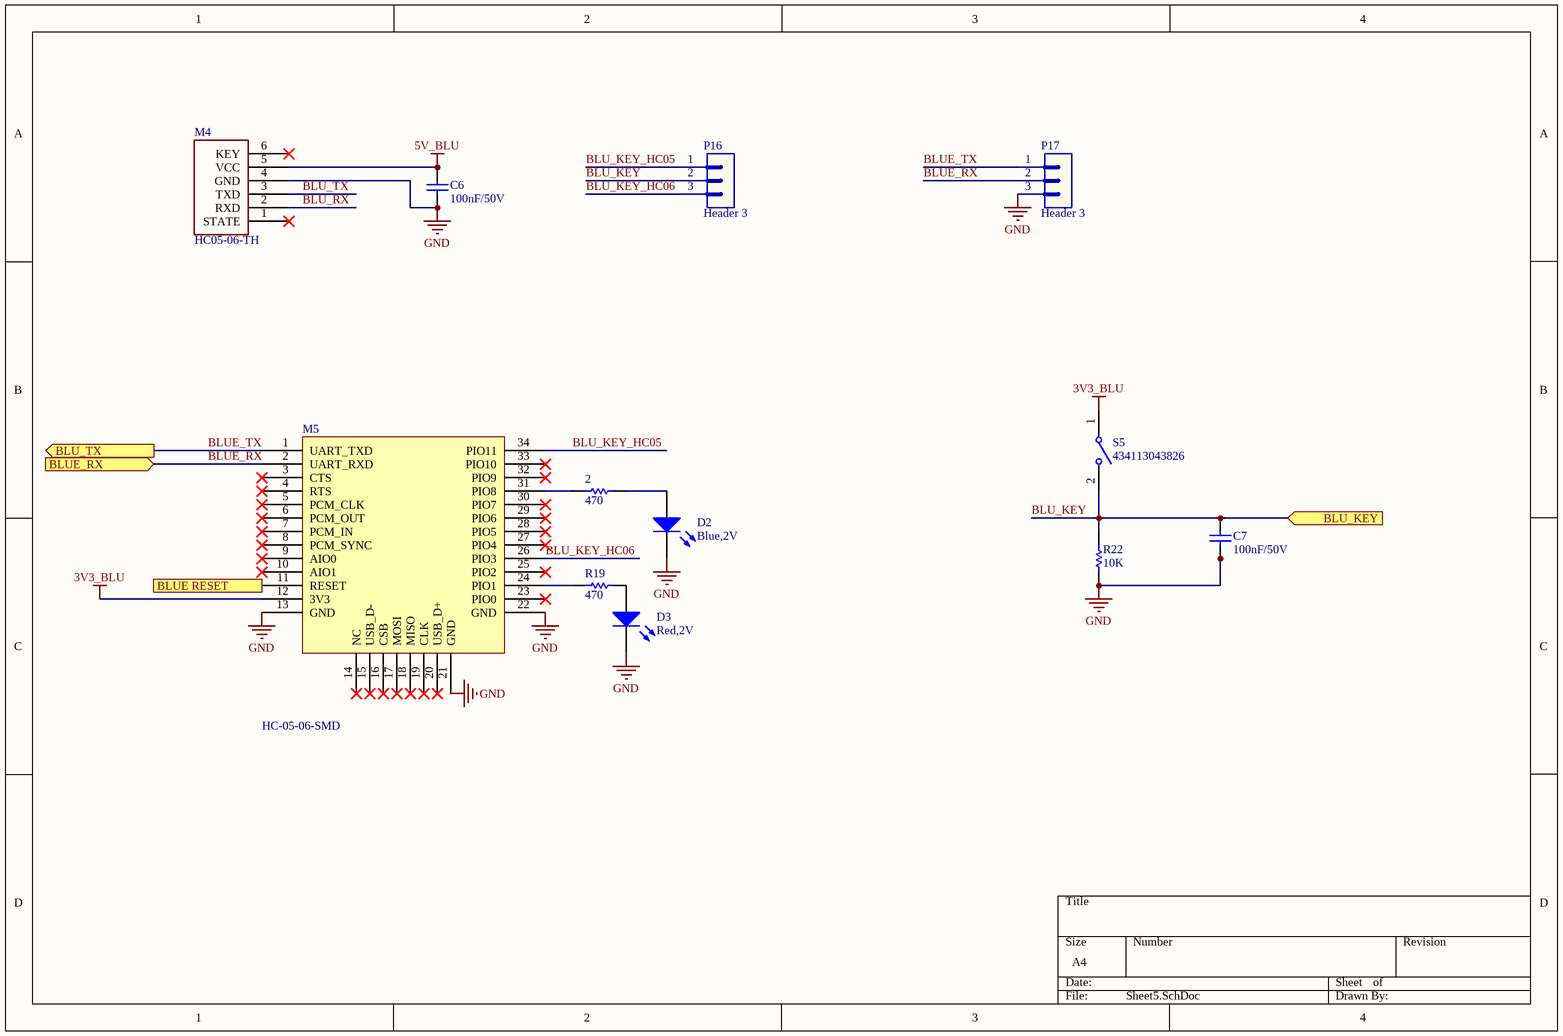
[diagram p5: Sheet5.SchDoc]

### Parts
(Parts that share a designator on the sheet are numbered #1, #2 ... from top to bottom, then left to right.)
2  value 470  [RES-SM-0805]  (hidden comment: Res-1K-0805)
C6  value 100nF/50V  [CAP-SM-0805]  (hidden comment: Cap-1nF-50V-0805)
C7  value 100nF/50V  [CAP-SM-0805]  (hidden comment: Cap-1nF-50V-0805)
D2  value Blue,2V  [LED-3mm]  (hidden comment: LED-BLUE-TH-3mm)
D3  value Red,2V  [LED-3mm]  (hidden comment: LED-RED-TH-3mm)
M4  HC05-06-TH  [HC-05-06-TH]
M5  HC-05-06-SMD  [HC-05-06-SMD]
P16#2  Header 3  [JP3]
P17#2  Header 3  [JP3]
R19#2  value 470  [RES-SM-0805]  (hidden comment: Res-1K-0805)
R22  value 10K  [RES-SM-0805]  (hidden comment: Res-0-0805)
S5  434113043826  [434113043826]

### Ports
BLU_KEY (in), BLU_TX (out), BLUE RESET (in), BLUE_RX (in)

### Nets
3v3_BLU: M5.12(3V3) S5.1
5V_BLU: C6.2 M4.5(VCC)  [project net 5V]
GND: C6.1 C7.1 D2.2(K) D3.2(K) M4.4(GND) M5.13(GND) M5.21(GND) M5.22(GND) P17#2.3 R22.2
BLU_KEY: C7.2 P16#2.2 R22.1 S5.2 ; port BLU_KEY
BLU_KEY_HC05: M5.34(PIO11) P16#2.1
BLU_KEY_HC06: M5.26(PIO3) P16#2.3
BLU_RX: M4.2(RXD)
BLU_TX: M4.3(TXD)
BLUE_RX: M5.2(UART_RXD) P17#2.2 ; port BLUE_RX
BLUE_TX: M5.1(UART_TXD) P17#2.1 ; port BLU_TX
Net2_1: 2.1 M5.31(PIO8)
Net2_2: 2.2 D2.1(A)
NetD3_1: D3.1(A) R19#2.2
NetM5_11: M5.11(RESET) ; port BLUE RESET
NetM5_24: M5.24(PIO1) R19#2.1

Not connected (* = marked no-connect by the designer): M4 1(STATE)* 6(KEY)*; M5 3(CTS)* 4(RTS)* 5(PCM_CLK)* 6(PCM_OUT)* 7(PCM_IN)* 8(PCM_SYNC)* 9(AIO0)* 10(AIO1)* 14(NC)* 15(USB_D-)* 16(CSB)* 17(MOSI)* 18(MISO)* 19(CLK)* 20(USB_D+)* 23(PIO0)* 25(PIO2)* 27(PIO4)* 28(PIO5)* 29(PIO6)* 30(PIO7)* 32(PIO9)* 33(PIO10)*

### Library data of the parts
2 R19#2 = Res-1K-0805: as R2 on sheet Sheet1; Local Supplier: thegioiic; Local Supplier Link: https://thegioiic.com/products/dien-tro-1k-ohm-0805-5; Supplier 1: Digikey; Supplier 1 Link: https://www.digikey.com/product-detail/en/stackpole-electronics-inc/RNCP0805FTD1K00/RNCP0805FTD1K00CT-ND/2240568; Supplier 1 Part Number: RNCP0805FTD1K00CT-ND
C6 C7 = Cap-1nF-50V-0805: as C19 on sheet Sheet2; Local Supplier: thegioiic; Local Supplier Link: https://thegioiic.com/products/tu-1nf-50v-0805; Supplier 1: Digikey; Supplier 1 Link: https://www.digikey.com/product-detail/en/johanson-dielectrics-inc/101X15W102MV4E/709-1335-1-ND/2327235; Supplier 1 Part Number: 709-1335-1-ND
D2 = LED-BLUE-TH-3mm: LED BLUE CLEAR T-1 T/H; Manufacturer: Kingbright; Manufacturer Part Number: WP710A10QBC/D; Local Supplier: thegioiic; Local Supplier Link: https://thegioiic.com/products/led-xanh-duong-3mm-chan-dai; Supplier 1: Digikey; Supplier 1 Link: https://www.digikey.com/product-detail/en/kingbright/WP710A10QBC-D/754-1596-ND/2769812; Supplier 1 Part Number: 754-1596-ND
D3 = LED-RED-TH-3mm: as D5 on sheet Sheet2; Local Supplier: thegioiic; Local Supplier Link: https://thegioiic.com/products/led-do-3mm-chan-dai; Supplier 1: Digikey; Supplier 1 Link: https://www.digikey.com/product-detail/en/kingbright/WP710A10SEC-J3/754-1589-ND/2769815; Supplier 1 Part Number: 754-1589-ND
M5 = HC-05-06-SMD: Local supply: Hshop
P16#2 P17#2 = Header 3: Header, 3-Pin; LatestRevisionDate: 17-Jul-2002; LatestRevisionNote: Re-released for DXP Platform.; Publisher: Altium Limited
R22 = Res-0-0805: as R16 on sheet Sheet2; Local Supplier: thegioiic; Local Supplier Link: https://thegioiic.com/products/dien-tro-0-ohm-0805-5; Supplier 1: Digikey; Supplier 1 Link: https://www.digikey.com/product-detail/en/vishay-dale/WSL080500000ZEA9/541-3928-1-ND/7423223; Supplier 1 Part Number: 541-3928-1-ND
S5 = 434113043826: as S3#1 on sheet Sheet2; ComponentLink1Description: Manufacturer; ComponentLink1URL: http://www.we-online.de; ComponentLink2Description: Datasheet; ComponentLink2URL: https://katalog.we-online.com/em/datasheet/434113043826.pdf; Operating Temperature: -40 to +85degC; Part Number: 434113043826; Published Date: September 2019; Contact Material: Stainless Steel; Height: 4.3mm; Mounting Technology: SMT; Contact Plating: Silver; Operation Force: 260gf; Packaging: Tape and Reel; Terminal Material: Copper Alloy; Publisher: Wurth Elektronik; Terminal Plating: Silver

## Sheet Sheet8.SchDoc
size A
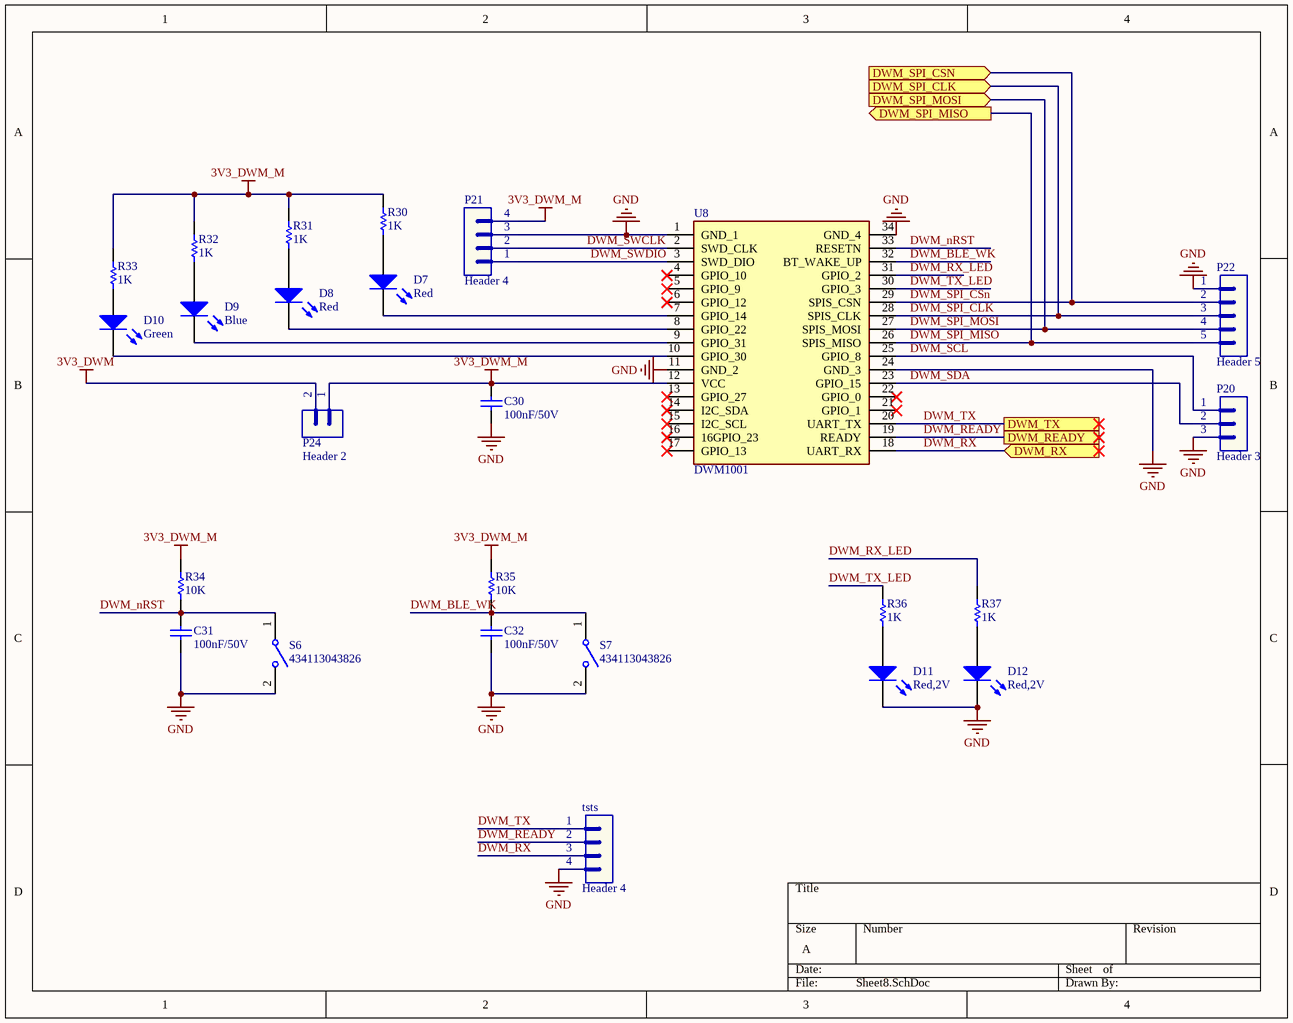
[diagram p6: Sheet8.SchDoc]

### Parts
(Parts that share a designator on the sheet are numbered #1, #2 ... from top to bottom, then left to right.)
C30  value 100nF/50V  [CAP-SM-0805]  (hidden comment: Cap-1nF-50V-0805)
C31  value 100nF/50V  [CAP-SM-0805]  (hidden comment: Cap-4.7uF-50V-0805)
C32  value 100nF/50V  [CAP-SM-0805]  (hidden comment: Cap-4.7uF-50V-0805)
D7  value Red  [LED-3mm]  (hidden comment: LED-RED-TH-3mm)
D8  value Red  [LED-3mm]  (hidden comment: LED-RED-TH-3mm)
D9  value Blue  [LED-3mm]  (hidden comment: LED-BLUE-TH-3mm)
D10  value Green  [LED-3mm]  (hidden comment: LED-GREEN-TH-3mm)
D11  value Red,2V  [LED-3mm]  (hidden comment: LED-RED-TH-3mm)
D12  value Red,2V  [LED-3mm]  (hidden comment: LED-RED-TH-3mm)
P20#2  Header 3  [JP3]
P21#2  Header 4  [JP4]
P22  Header 5  [JP5]
P24  Header 2  [JP2]
R30  value 1K  [RES-SM-0805]  (hidden comment: Res-0-0805)
R31  value 1K  [RES-SM-0805]  (hidden comment: Res-0-0805)
R32  value 1K  [RES-SM-0805]  (hidden comment: Res-0-0805)
R33  value 1K  [RES-SM-0805]  (hidden comment: Res-0-0805)
R34  value 10K  [RES-SM-0805]  (hidden comment: Res-1K-0805)
R35  value 10K  [RES-SM-0805]  (hidden comment: Res-1K-0805)
R36  value 1K  [RES-SM-0805]  (hidden comment: Res-1K-0805)
R37  value 1K  [RES-SM-0805]  (hidden comment: Res-1K-0805)
S6  434113043826  [434113043826]
S7  434113043826  [434113043826]
tsts  Header 4  [JP4]
U8  DWM1001  [DWM1001]

### Ports
DWM_READY, DWM_RX (in), DWM_SPI_CLK (in), DWM_SPI_CSN (in), DWM_SPI_MISO (out), DWM_SPI_MOSI (in), DWM_TX

### Nets
3v3_DWM: P24.2
3V3_DWM_M: C30.2 P21#2.4 P24.1 R30.2 R31.2 R32.2 R33.1 R34.2 R35.2 U8.12(VCC)
GND: C30.1 C31.1 C32.1 D11.2(K) D12.2(K) P20#2.3 P21#2.3 P22.1 S6.2 S7.2 tsts.4 U8.1(GND_1) U8.11(GND_2) U8.24(GND_3) U8.34(GND_4)
DWM_BLE_WK: C32.2 R35.1 S7.1 U8.32(BT_WAKE_UP)
DWM_nRST: C31.2 R34.1 S6.1 U8.33(RESETN)
DWM_READY: tsts.2 U8.19(READY) ; port DWM_READY
DWM_RX: tsts.3 U8.18(UART_RX) ; port DWM_RX
DWM_RX_LED: R37.2 U8.31(GPIO_2)
DWM_SCL: P20#2.1 U8.25(GPIO_8)
DWM_SDA: P20#2.2 U8.23(GPIO_15)
DWM_SPI_CLK: P22.3 U8.28(SPIS_CLK) ; port DWM_SPI_CLK
DWM_SPI_CSn: P22.2 U8.29(SPIS_CSN) ; port DWM_SPI_CSN
DWM_SPI_MISO: P22.5 U8.26(SPIS_MISO) ; port DWM_SPI_MISO
DWM_SPI_MOSI: P22.4 U8.27(SPIS_MOSI) ; port DWM_SPI_MOSI
DWM_SWCLK: P21#2.2 U8.2(SWD_CLK)
DWM_SWDIO: P21#2.1 U8.3(SWD_DIO)
DWM_TX: tsts.1 U8.20(UART_TX) ; port DWM_TX
DWM_TX_LED: R36.2 U8.30(GPIO_3)
NetD7_1: D7.1(A) R30.1
NetD7_2: D7.2(K) U8.7(GPIO_14)
NetD8_1: D8.1(A) R31.1
NetD8_2: D8.2(K) U8.8(GPIO_22)
NetD9_1: D9.1(A) R32.1
NetD9_2: D9.2(K) U8.9(GPIO_31)
NetD10_2: D10.2(K) U8.10(GPIO_30)
NetD11_1: D11.1(A) R36.1
NetD12_1: D12.1(A) R37.1

Not connected (* = marked no-connect by the designer): D10 1(A); R33 2; U8 4(GPIO_10)* 5(GPIO_9)* 6(GPIO_12)* 13(GPIO_27)* 14(I2C_SDA)* 15(I2C_SCL)* 16(16GPIO_23)* 17(GPIO_13)* 21(GPIO_1)* 22(GPIO_0)*

### Library data of the parts
C30 = Cap-1nF-50V-0805: as C19 on sheet Sheet2; Local Supplier: thegioiic; Local Supplier Link: https://thegioiic.com/products/tu-1nf-50v-0805; Supplier 1: Digikey; Supplier 1 Link: https://www.digikey.com/product-detail/en/johanson-dielectrics-inc/101X15W102MV4E/709-1335-1-ND/2327235; Supplier 1 Part Number: 709-1335-1-ND
C31 C32 = Cap-4.7uF-50V-0805: CAP CER 4.7UF 50V X5R 0805; Manufacturer: Murata Electronics; Manufacturer Part Number: GRM21BR61H475KE51L; Local Supplier: thegioiic; Local Supplier Link: https://thegioiic.com/products/tu-4-7uf-50v-0805-cap; Supplier 1: Digikey; Supplier 1 Link: https://www.digikey.com/product-detail/en/murata-electronics/GRM21BR61H475KE51L/490-10751-1-ND/5251349; Supplier 1 Part Number: 490-10751-1-ND
D7 D8 D11 D12 = LED-RED-TH-3mm: as D5 on sheet Sheet2; Local Supplier: thegioiic; Local Supplier Link: https://thegioiic.com/products/led-do-3mm-chan-dai; Supplier 1: Digikey; Supplier 1 Link: https://www.digikey.com/product-detail/en/kingbright/WP710A10SEC-J3/754-1589-ND/2769815; Supplier 1 Part Number: 754-1589-ND
D9 = LED-BLUE-TH-3mm: as D2 on sheet Sheet5; Local Supplier: thegioiic; Local Supplier Link: https://thegioiic.com/products/led-xanh-duong-3mm-chan-dai; Supplier 1: Digikey; Supplier 1 Link: https://www.digikey.com/product-detail/en/kingbright/WP710A10QBC-D/754-1596-ND/2769812; Supplier 1 Part Number: 754-1596-ND
D10 = LED-GREEN-TH-3mm: LED GREEN CLEAR T-1 T/H; Manufacturer: Kingbright; Manufacturer Part Number: WP710A10ZGC/G; Local Supplier: thegioiic; Local Supplier Link: https://thegioiic.com/products/led-xanh-la-3mm-chan-dai; Supplier 1: Digikey; Supplier 1 Link: https://www.digikey.com/product-detail/en/kingbright/WP710A10ZGC-G/754-1612-ND/2769684; Supplier 1 Part Number: 754-1612-ND
P20#2 = Header 3: Header, 3-Pin; LatestRevisionDate: 17-Jul-2002; LatestRevisionNote: Re-released for DXP Platform.; Publisher: Altium Limited
P21#2 tsts = Header 4: Header, 4-Pin; LatestRevisionDate: 17-Jul-2002; LatestRevisionNote: Re-released for DXP Platform.; Publisher: Altium Limited
P22 = Header 5: Header, 5-Pin; LatestRevisionDate: 17-Jul-2002; LatestRevisionNote: Re-released for DXP Platform.; Publisher: Altium Limited
P24 = Header 2: Header, 2-Pin; LatestRevisionDate: 17-Jul-2002; LatestRevisionNote: Re-released for DXP Platform.; Publisher: Altium Limited
R30-R33 = Res-0-0805: as R16 on sheet Sheet2; Local Supplier: thegioiic; Local Supplier Link: https://thegioiic.com/products/dien-tro-0-ohm-0805-5; Supplier 1: Digikey; Supplier 1 Link: https://www.digikey.com/product-detail/en/vishay-dale/WSL080500000ZEA9/541-3928-1-ND/7423223; Supplier 1 Part Number: 541-3928-1-ND
R34-R37 = Res-1K-0805: as R2 on sheet Sheet1; Local Supplier: thegioiic; Local Supplier Link: https://thegioiic.com/products/dien-tro-1k-ohm-0805-5; Supplier 1: Digikey; Supplier 1 Link: https://www.digikey.com/product-detail/en/stackpole-electronics-inc/RNCP0805FTD1K00/RNCP0805FTD1K00CT-ND/2240568; Supplier 1 Part Number: RNCP0805FTD1K00CT-ND
S6 S7 = 434113043826: as S3#1 on sheet Sheet2; ComponentLink1Description: Manufacturer; ComponentLink1URL: http://www.we-online.de; ComponentLink2Description: Datasheet; ComponentLink2URL: https://katalog.we-online.com/em/datasheet/434113043826.pdf; Operating Temperature: -40 to +85degC; Part Number: 434113043826; Published Date: September 2019; Contact Material: Stainless Steel; Height: 4.3mm; Mounting Technology: SMT; Contact Plating: Silver; Operation Force: 260gf; Packaging: Tape and Reel; Terminal Material: Copper Alloy; Publisher: Wurth Elektronik; Terminal Plating: Silver
U8 = DWM1001: Manufacturer_Name: Decawave Limited; Datasheet Link: https://www.decawave.com/sites/default/files/dwm1001_datasheet.pdf; Height: 3mm; Manufacturer_Part_Number: DWM1001; Arrow Part Number: DWM1001

## Sheet Sheet7.SchDoc
size A
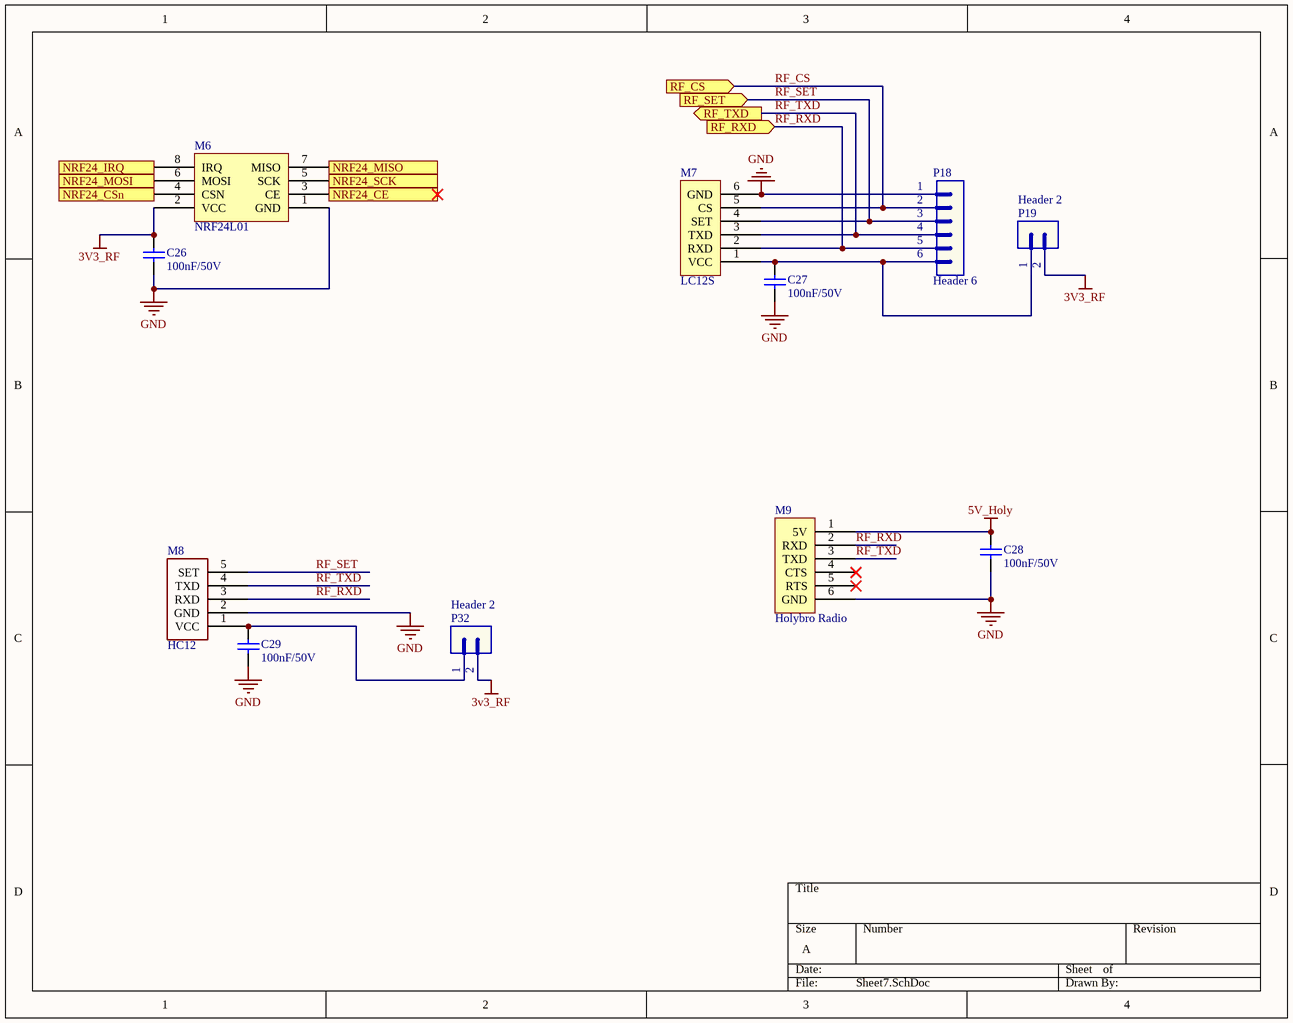
[diagram p7: Sheet7.SchDoc]

### Parts
(Parts that share a designator on the sheet are numbered #1, #2 ... from top to bottom, then left to right.)
C26  value 100nF/50V  [CAP-SM-0805]  (hidden comment: Cap-1nF-50V-0805)
C27  value 100nF/50V  [CAP-SM-0805]  (hidden comment: Cap-1nF-50V-0805)
C28  value 100nF/50V  [CAP-SM-0805]  (hidden comment: Cap-1nF-50V-0805)
C29  value 100nF/50V  [CAP-SM-0805]  (hidden comment: Cap-1nF-50V-0805)
M6  NRF24L01  [NRF24L01]
M7  LC12S  [LC12S]
M8  HC12  [HC12]
M9  Holybro Radio  [Holybro]
P18#2  Header 6  [JP6]
P19#2  Header 2  [JP2]
P32  Header 2  [JP2]

### Ports
NRF24_CE (in), NRF24_CSn (in), NRF24_IRQ (out), NRF24_MISO (out), NRF24_MOSI (in), NRF24_SCK (in), RF_CS (in), RF_RXD (in), RF_SET (in), RF_TXD (out)

### Nets
3V3_RF: C26.2 M6.2(VCC) P19#2.2 P32.2
5V_Holy: C28.2 M9.1(5V)  [project net 5V]
GND: C26.1 C27.1 C28.1 C29.1 M6.1(GND) M7.6(GND) M8.2(GND) M9.6(GND) P18#2.1
RF_CS: M7.5(CS) P18#2.2 ; port RF_CS
RF_RXD: M7.2(RXD) M8.3(RXD) M9.2(RXD) P18#2.5 ; port RF_RXD
RF_SET: M7.4(SET) M8.5(SET) P18#2.3 ; port RF_SET
RF_TXD: M7.3(TXD) M8.4(TXD) M9.3(TXD) P18#2.4 ; port RF_TXD
NetC27_2: C27.2 M7.1(VCC) P18#2.6 P19#2.1
NetC29_2: C29.2 M8.1(VCC) P32.1
NetCR1_33: M6.8(IRQ) ; port NRF24_IRQ
NetCR1_38: M6.4(CSN) ; port NRF24_CSn
NetCR1_39: M6.5(SCK) ; port NRF24_SCK
NetCR1_40: M6.7(MISO) ; port NRF24_MISO
NetCR1_41: M6.6(MOSI) ; port NRF24_MOSI
NetM6_3: M6.3(CE) ; port NRF24_CE

Not connected (* = marked no-connect by the designer): M9 4(CTS)* 5(RTS)*

### Library data of the parts
C26-C29 = Cap-1nF-50V-0805: as C19 on sheet Sheet2; Local Supplier: thegioiic; Local Supplier Link: https://thegioiic.com/products/tu-1nf-50v-0805; Supplier 1: Digikey; Supplier 1 Link: https://www.digikey.com/product-detail/en/johanson-dielectrics-inc/101X15W102MV4E/709-1335-1-ND/2327235; Supplier 1 Part Number: 709-1335-1-ND
M6 = NRF24L01: Local supply: Hshop; Local supply link: https://lastminuteengineers.com/nrf24l01-arduino-wireless-communication/
M7 = LC12S: Local supply: HShop; Local supply link: https://hshop.vn/products/mach-thu-phat-rf-uart-lc12s-2-4ghz
M8 = HC12: Local supply: Hshop; Local supply number: HS000897; Local supply link: https://hshop.vn/products/mach-thu-phat-rf-uart-si4463-433mhzkhoang-coch-1km
M9 = Holybro: Supplier: https://www.lazada.vn/products/ld-holybro-433mhz-915-mhz-500-mw-thu-phat-vo-tuyen-xa-bo-v3-cho-pixhawk-4-dieu-khien-chuyen-bay-i430804435-s768474304.html?spm=a2o4n.searchlist.list.4.25396b19yIS9XO&search=1
P18#2 = Header 6: Header, 6-Pin; LatestRevisionDate: 17-Jul-2002; LatestRevisionNote: Re-released for DXP Platform.; Publisher: Altium Limited
P19#2 P32 = Header 2: Header, 2-Pin; LatestRevisionDate: 17-Jul-2002; LatestRevisionNote: Re-released for DXP Platform.; Publisher: Altium Limited

## Nets that join several sheets
3v3_BLU: Sheet1 (C14.2 IC4.2 IC4.4), Sheet5 (M5.12 S5.1)
3v3_DWM: Sheet1 (C13.2 IC3.2 IC3.4), Sheet8 (P24.2)
3V3_MC: Sheet1 (C10.2 C11.2 IC2.2 IC2.4), Sheet2 (D5.1 R16.2 R17.2), Sheet3 (6 pins), Sheet4 (11 pins)
3V3_RF: Sheet1 (C35.2 U1.5), Sheet7 (C26.2 M6.2 P19#2.2 P32.2)
3v3_WIFI: Sheet1 (C12.2 IC1.2 IC1.4), Sheet6 (11 pins)
5V: Sheet1 (10 pins), Sheet2 (B1.1 J1.1), Sheet4 (P10.3), Sheet5 (C6.2 M4.5), Sheet7 (C28.2 M9.1)
5V_WIFI: Sheet1 (P12#1.2), Sheet6 (C17.2 C18#2.2 D6.1 U4#3.8)
12V: Sheet1 (C1.2 C8.2 P1.1 U4#1.1), Sheet4 (P9.1 P11.1)
GND: Sheet1 (18 pins), Sheet2 (16 pins), Sheet3 (6 pins), Sheet4 (19 pins), Sheet6 (14 pins), Sheet5 (10 pins), Sheet8 (15 pins), Sheet7 (9 pins)
BLUE_RX: Sheet2 (CR1.30), Sheet5 (M5.2 P17#2.2)
DWM_SPI_CLK: Sheet2 (CR1.26), Sheet8 (P22.3 U8.28)
DWM_SPI_CSn: Sheet2 (CR1.25), Sheet8 (P22.2 U8.29)
DWM_SPI_MISO: Sheet2 (CR1.27), Sheet8 (P22.5 U8.26)
DWM_SPI_MOSI: Sheet2 (CR1.28), Sheet8 (P22.4 U8.27)
ESP_TX: Sheet2 (CR1.13), Sheet6 (*.22 U4#3.25)
NetCR1_3: Sheet2 (CR1.3), Sheet4 (U4#2.3)
NetCR1_4: Sheet2 (CR1.4), Sheet4 (U4#2.6)
NetCR1_5: Sheet2 (CR1.5), Sheet4 (U4#2.5)
NetCR1_6: Sheet2 (CR1.6), Sheet4 (U4#2.7)
NetCR1_10: Sheet2 (CR1.10), Sheet4 (U4#2.2)
NetCR1_11: Sheet2 (CR1.11), Sheet4 (U4#2.4)
NetCR1_12: Sheet2 (CR1.12), Sheet6 (R11#2.1)
NetCR1_15: Sheet1 (R3.2), Sheet2 (CR1.15)
NetCR1_16: Sheet2 (CR1.16), Sheet3 (U2.2)
NetCR1_17: Sheet2 (CR1.17), Sheet3 (U2.4)
NetCR1_33: Sheet2 (CR1.33), Sheet7 (M6.8)
NetCR1_38: Sheet2 (CR1.38), Sheet7 (M6.4)
NetCR1_39: Sheet2 (CR1.39), Sheet7 (M6.5)
NetCR1_40: Sheet2 (CR1.40), Sheet7 (M6.7)
NetCR1_41: Sheet2 (CR1.41), Sheet7 (M6.6)
NetCR1_42: Sheet2 (CR1.42), Sheet3 (U2.8)
NetCR1_43: Sheet2 (CR1.43), Sheet3 (U2.6)
NetCR1_45: Sheet2 (CR1.45), Sheet3 (M3#1.3)
NetCR1_46: Sheet2 (CR1.46), Sheet3 (M3#1.4)
RF_RXD: Sheet2 (CR1.21), Sheet7 (M7.2 M8.3 M9.2 P18#2.5)
RF_SET: Sheet2 (CR1.19), Sheet7 (M7.4 M8.5 P18#2.3)
RF_TXD: Sheet2 (CR1.22), Sheet7 (M7.3 M8.4 M9.3 P18#2.4)